# Altium schematic sheet 23cm_amplifier.SchDoc: 23cm amplifier with YP2233W
size A3; DrawnBy: Lars Horvath; Organization: HB9ZZ; DocumentNumber: 1; Revision: 1.0
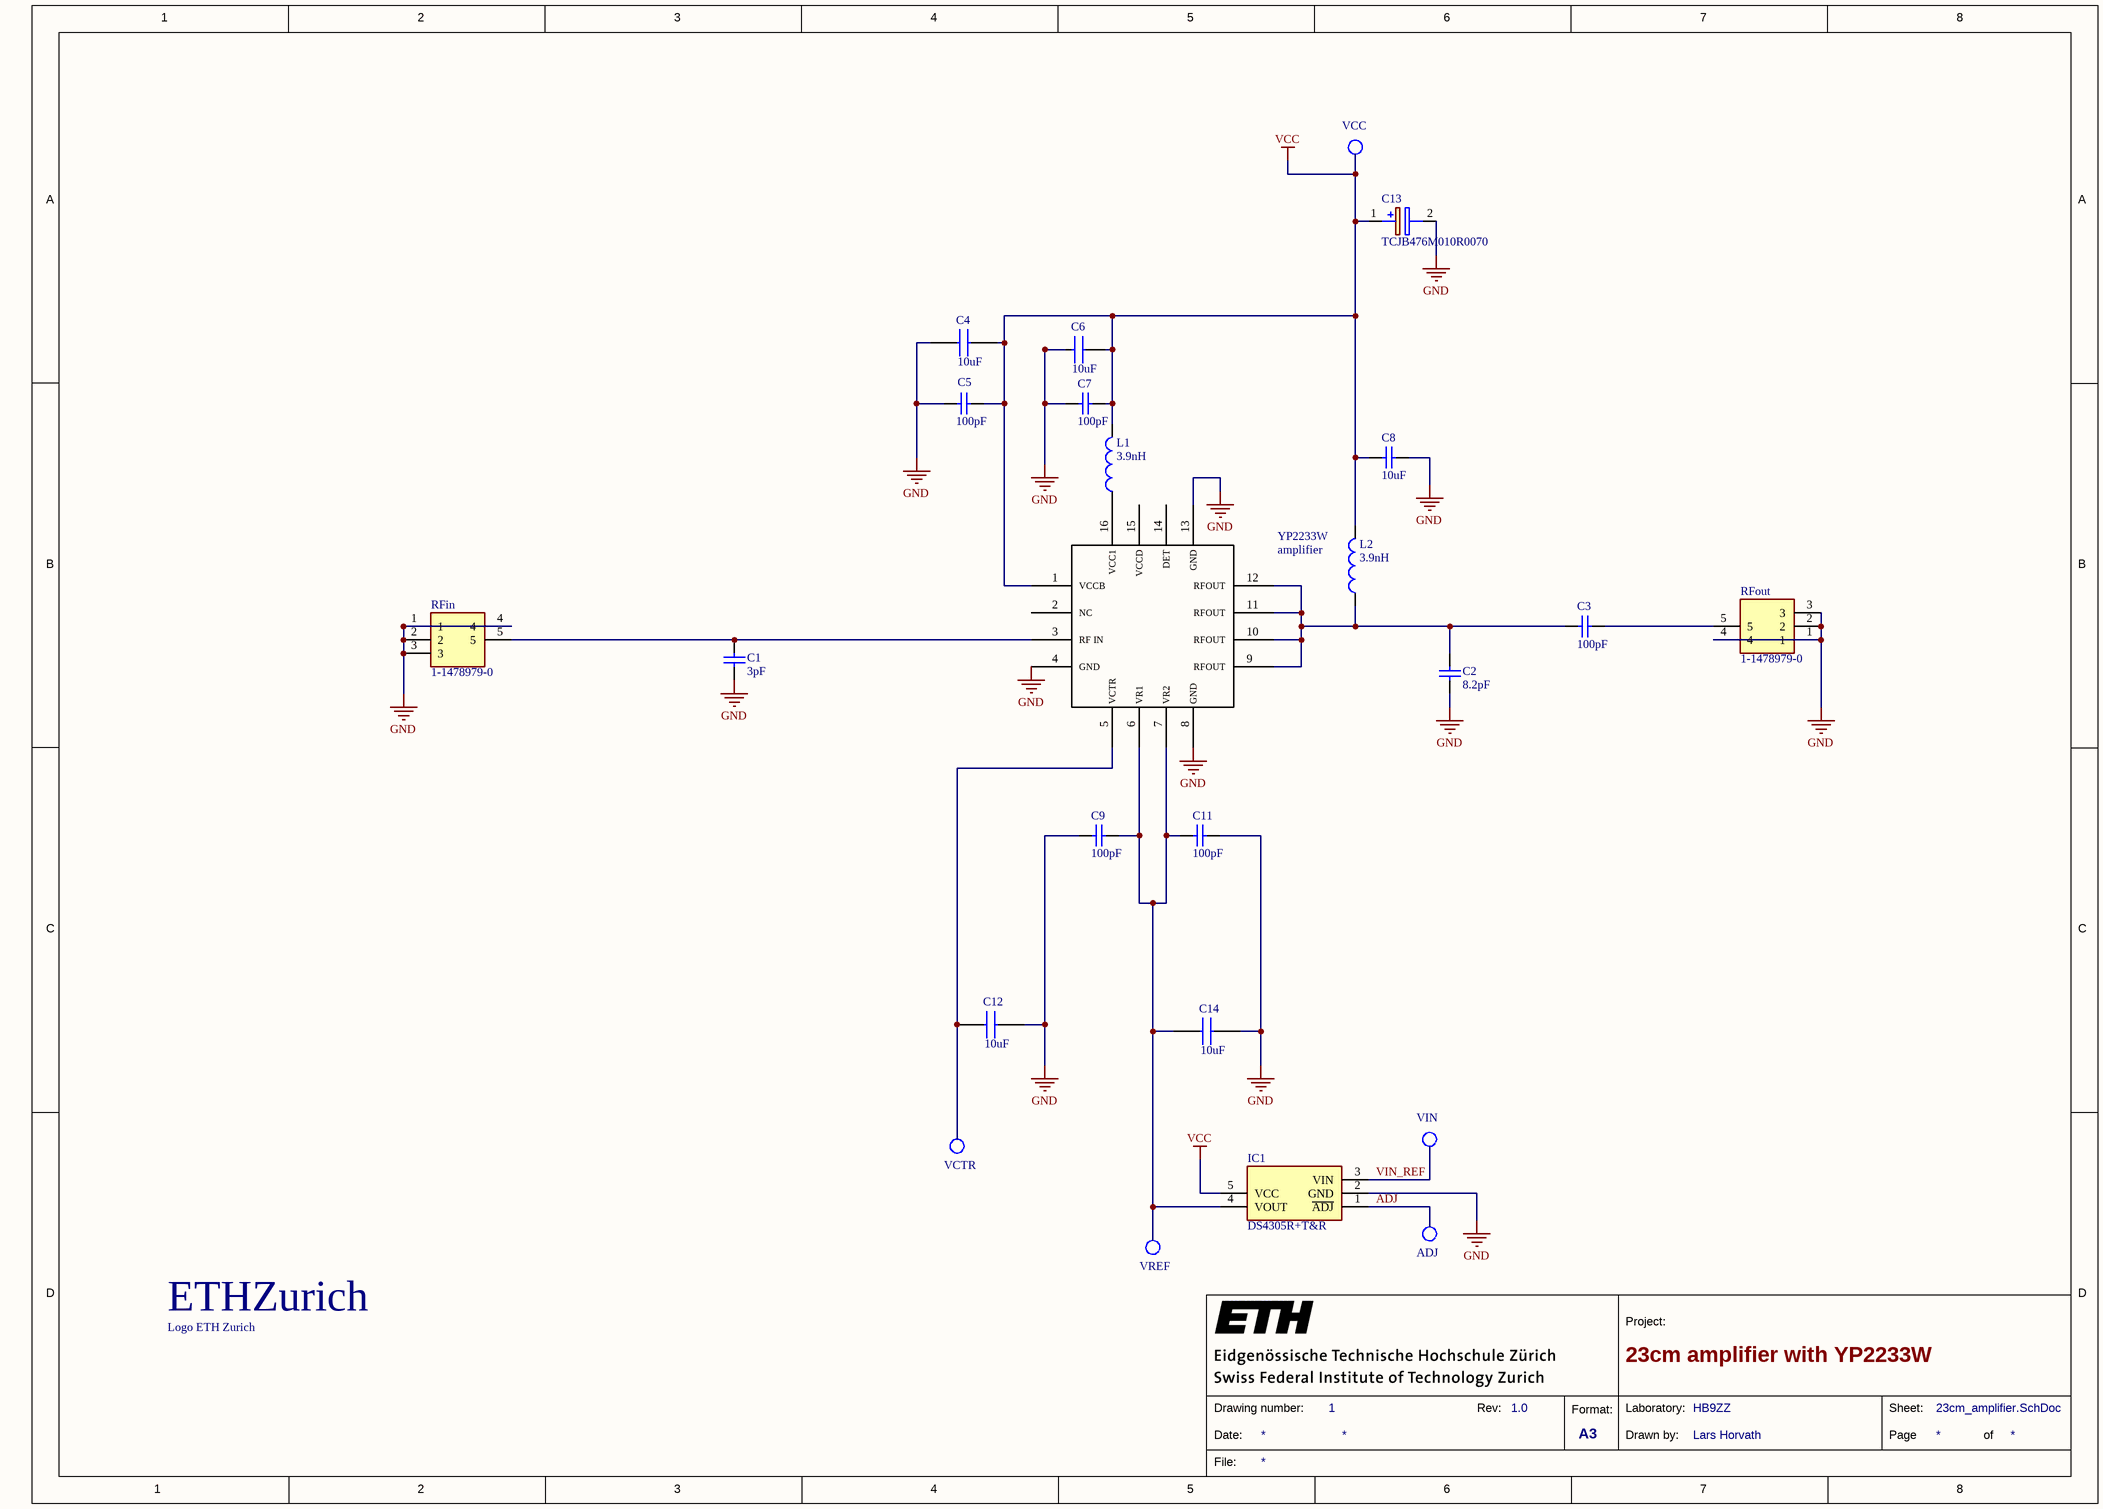
[diagram p0: 23cm_amplifier.SchDoc]

## Parts
A1  Logo ETH Zurich  [eth-zurich_3mm]  (no BOM)
C1  value 3pF  [CAPC0402(1005)70_N]  (hidden comment: 04023J3R0ABSTR)
C2  value 8.2pF  [CAPC0402(1005)70_N]  (hidden comment: 0402YJ8R2BBSTR)
C3  value 100pF  [CAPC0402(1005)70_N]  (hidden comment: C1005C0G1H101J050BE)
C4  Capacity: 10uF  [CAPC2012X145N]  (hidden comment: C2012X8L1A106K125AC)
C5  value 100pF  [CAPC0402(1005)70_N]  (hidden comment: C1005C0G1H101J050BE)
C6  Capacity: 10uF  [CAPC2012X145N]  (hidden comment: C2012X8L1A106K125AC)
C7  value 100pF  [CAPC0402(1005)70_N]  (hidden comment: C1005C0G1H101J050BE)
C8  value 10uF  [CAPC0402(1005)70_N]  (hidden comment: GRM155R60J106ME15J)
C9  value 100pF  [CAPC0402(1005)70_N]  (hidden comment: C1005C0G1H101J050BE)
C11  value 100pF  [CAPC0402(1005)70_N]  (hidden comment: C1005C0G1H101J050BE)
C12  Capacity: 10uF  [CAPC2012X145N]  (hidden comment: C2012X8L1A106K125AC)
C13  TCJB476M010R0070  [CAPPM3528X210N]
C14  Capacity: 10uF  [CAPC2012X145N]  (hidden comment: C2012X8L1A106K125AC)
IC1  DS4305R+T&R  [SOT95P280X145-5N]
L1  value 3.9nH  [INDC1005X07N]  (hidden comment: LQW15AN3N9B8ZD)
L2  value 3.9nH  [INDC1005X07N]  (hidden comment: LQW15AN3N9B8ZD)
RFin  1-1478979-0  [114789790]
RFout  1-1478979-0  [114789790]
YP2233W  amplifier  [YP2233W]

## Nets
GND: C1.1 C2.1 C4.1 C5.1 C6.1 C7.1 C8.2 C9.1 C11.2 C12.2 C13.2(-) C14.2 IC1.2(GND) RFin.1 RFin.2 RFin.3 RFin.4 RFout.1 RFout.2 RFout.3 RFout.4 YP2233W.4(GND) YP2233W.8(GND) YP2233W.13(GND)
VCC: C4.2 C5.2 C6.2 C7.2 C8.1 C13.1(+) IC1.5(VCC) L1.2 L2.2 YP2233W.1(VCCB)
ADJ: IC1.1(~{ADJ})
VIN_REF: IC1.3(VIN)
NetC1_2: C1.2 RFin.5 YP2233W.3(RF_IN)
NetC2_2: C2.2 C3.1 L2.1 YP2233W.9(RFOUT) YP2233W.10(RFOUT) YP2233W.11(RFOUT) YP2233W.12(RFOUT)
NetC3_2: C3.2 RFout.5
NetC9_2: C9.2 C11.1 C14.1 IC1.4(VOUT) YP2233W.6(VR1) YP2233W.7(VR2)
NetC12_1: C12.1 YP2233W.5(VCTR)
NetL1_1: L1.1 YP2233W.16(VCC1)

Not connected (* = marked no-connect by the designer): YP2233W 2(NC) 14(DET) 15(VCCD)

## Notes on the sheet
- VCC
- VIN
- VCTR
- ADJ
- VREF
- 1
- 2
- 3
- 4
- 5
- 6
- 7
- 8
- A
- B
- C
- D
- Project:
- Date:
- Drawing number:
- Rev:
- Format:
- A3
- Drawn by:
- Laboratory:
- Page
- Sheet:
- of
- File:
- (in symbol CMP-00038-1) ETHZurich

## Library data of the parts
A1 = CMP-00038-1
C1 = CMP-00674-1: Silizium-HF-Kondensatoren / Dünnfilm 25V 3pF .05pFTol ThinFilm 0402; Manufacturer: Murata; Tolerance: 5%; Dielectric: C0G(NP0); Mount: Surface Mount; Case/Package: 0402; Case Code (Metric): 1005; Case Code (Imperial): 0402; Min Operating Temperature: -55°C; Max Operating Temperature: 125°C; Capacitance: 3pF; Voltage Rating (DC): 25V; Termination: SMD/SMT; Length: 1mm; Height: 0.5mm; Width: 0.02inch; Thickness: 0.022inch; Depth: 0.5mm; Lead Free: Lead Free; Manufacturer Part Number: 04023J3R0ABSTR; ComponentLink1Description: Mouser; ComponentLink1URL: https://www.mouser.ch/ProductDetail/581-04023J3R0ABSTR
C2 = CMP-00674-1: Silizium-HF-Kondensatoren / Dünnfilm 16V 8.2pF .1pFTol ThinFilm 0402 / RoHS-konform; Manufacturer: Murata; Manufacturer Part Number: GRM1555C1E560JA01D; Tolerance: 5%; Voltage Rating (DC): 25V; Dielectric: C0G(NP0); Mount: Surface Mount; Case/Package: 0402; Case Code (Metric): 1005; Case Code (Imperial): 0402; Min Operating Temperature: -55°C; Max Operating Temperature: 125°C; Capacitance: 8.2pF; Termination: SMD/SMT; Length: 1mm; Height: 0.5mm; Width: 0.02inch; Thickness: 0.022inch; Depth: 0.5mm; Lead Free: Lead Free; ComponentLink1Description: Mouser; ComponentLink1URL: https://www.mouser.ch/ProductDetail/581-0402YJ8R2BBSTR
C3 C5 C7 C9 C11 = CMP-00674-1: Kondensator aus mehreren Keramikschichten MLCC - SMD/SMT SOFT 0402 50V 100pF C0G 5% T: 0.5mm / RoHS-konform; Manufacturer: TDK; Voltage Rating (DC): 25V; Dielectric: C0G(NP0); Mount: Surface Mount; Case/Package: 0402; Case Code (Metric): 1005; Case Code (Imperial): 0402; Min Operating Temperature: -55°C; Max Operating Temperature: 125°C; Capacitance: 100pF; Tolerance: 5%; Termination: SMD/SMT; Length: 1mm; Height: 0.5mm; Width: 0.02inch; Thickness: 0.022inch; Depth: 0.5mm; Lead Free: Lead Free; Manufacturer Part Number: C1005C0G1H101J050BE; ComponentLink1Description: Mouser; ComponentLink1URL: https://www.mouser.ch/ProductDetail/810-C1005C0G1H101JBE
C4 C6 C12 C14 = C2012X8L1A106K125AC: Kondensator aus mehreren Keramikschichten MLCC - SMD/SMT 0805 10VDC 10uF 10% X8L; Manufacturer_Name: TDK; Datasheet Link: https://product.tdk.com/info/en/catalog/datasheets/mlcc_commercial_midvoltage_en.pdf; Height: 1.45mm; Manufacturer_Part_Number: C2012X8L1A106K125AC; Mouser Part Number: 810-C2012X8L106K125C; Mouser Price/Stock: https://www.mouser.co.uk/ProductDetail/TDK/C2012X8L1A106K125AC?qs=P1JMDcb91o46CKBinU4Lfg%3D%3D; ComponentLink1Description: Mouser; ComponentLink1URL: https://www.mouser.ch/ProductDetail/810-C2012X8L106K125C
C8 = CMP-00674-1: Kondensator aus mehreren Keramikschichten MLCC - SMD/SMT 10UF 6.3V 20% 0402 / RoHS-konform; Manufacturer: Murata; Tolerance: 5%; Voltage Rating (DC): 25V; Dielectric: C0G(NP0); Mount: Surface Mount; Case/Package: 0402; Case Code (Metric): 1005; Case Code (Imperial): 0402; Min Operating Temperature: -55°C; Max Operating Temperature: 125°C; Capacitance: 10uF; Termination: SMD/SMT; Length: 1mm; Height: 0.5mm; Width: 0.02inch; Thickness: 0.022inch; Depth: 0.5mm; Lead Free: Lead Free; Manufacturer Part Number: GRM155R60J106ME15J; ComponentLink1Description: Mouser; ComponentLink1URL: https://www.mouser.ch/ProductDetail/81-GRM155R60J106ME5J
C13 = TCJB476M010R0070: Tantalum Capacitors - Polymer 10V 47uF 20% 1210 ESR=70mOhm; Manufacturer_Name: AVX; Datasheet Link: http://datasheets.avx.com/TCJ.pdf; Height: 2.1mm; Manufacturer_Part_Number: TCJB476M010R0070; Arrow Part Number: TCJB476M010R0070; Arrow Price/Stock: https://www.arrow.com/en/products/tcjb476m010r0070/avx; Mouser Part Number: 581-TCJB476M10R70; Mouser Price/Stock: https://www.mouser.com/Search/Refine.aspx?Keyword=581-TCJB476M10R70; ComponentLink1Description: Mouser; ComponentLink1URL: https://www.mouser.ch/ProductDetail/581-TCJB476M10R70
IC1 = DS4305R+T&R: Programmable Reference Voltage for 2.65V; Manufacturer_Name: Maxim Integrated; Datasheet Link: https://componentsearchengine.com/Datasheets/1/DS4305R+T&R.pdf; Height: 1.45mm; Manufacturer_Part_Number: DS4305R+T&R; Mouser Part Number: 700-DS4305RT&R; Mouser Price/Stock: https://www.mouser.co.uk/ProductDetail/Maxim-Integrated/DS4305R%2bTR?qs=GxOUx7aO6nxNFZIWlDSGaA%3D%3D; ComponentLink1Description: Datasheet; ComponentLink1URL: https://www.mouser.ch/datasheet/2/256/DS4305-DS4305K-1514614.pdf; ComponentLink2Description: Mouser; ComponentLink2URL: https://www.mouser.ch/ProductDetail/Maxim-Integrated/DS4305R%2bTR?qs=GxOUx7aO6nxNFZIWlDSGaA%3D%3D
L1 L2 = CMP-00986-1: Festinduktivitäten 0402 3.9nH 1950mA 0.03ohms 10GHz; Core Material: Ceramic; Tolerance: 5%; Current Rating: 250mA; Shielding: Unshielded; DC Resistance (DCR): 900mR; Self Resonant Frequency: 1.6GHz; Mount: Surface Mount; Case/Package: 0402; Case Code (Metric): 1005; Case Code (Imperial): 0402; Min Operating Temperature: -55°C; Max Operating Temperature: 125°C; Packaging: Tape and Reel; Inductance: 3.9nH; Test Frequency: 10GHz; Max DC Current: 250mA; DC Current: 250mA; Military Standard: Not; Length: 0.039inch; Height: 0.55mm; Width: 0.02inch; Depth: 0.55mm; Radiation Hardening: No; ComponentLink1Description: Mouser; ComponentLink1URL: https://www.mouser.ch/ProductDetail/81-LQW15AN3N9B8ZD
RFin = 1-1478979-0: RF IN; Manufacturer_Name: TE Connectivity; Datasheet Link: http://www.te.com/commerce/DocumentDelivery/DDEController?Action=showdoc&DocId=Customer+Drawing%7F1478979%7FB%7Fpdf%7FEnglish%7FENG_CD_1478979_B.pdf%7F1-1478979-0; Height: 10mm; Manufacturer_Part_Number: 1-1478979-0; Arrow Part Number: 1-1478979-0; Arrow Price/Stock: https://www.arrow.com/en/products/1-1478979-0/te-connectivity; Mouser Part Number: 571-1-1478979-0; Mouser Price/Stock: https://www.mouser.co.uk/ProductDetail/TE-Connectivity/1-1478979-0?qs=Vcr9%2FL0R50jLfIYfi0kfuw%3D%3D
RFout = 1-1478979-0: RF OUT; Manufacturer_Name: TE Connectivity; Datasheet Link: http://www.te.com/commerce/DocumentDelivery/DDEController?Action=showdoc&DocId=Customer+Drawing%7F1478979%7FB%7Fpdf%7FEnglish%7FENG_CD_1478979_B.pdf%7F1-1478979-0; Height: 10mm; Manufacturer_Part_Number: 1-1478979-0; Arrow Part Number: 1-1478979-0; Arrow Price/Stock: https://www.arrow.com/en/products/1-1478979-0/te-connectivity; Mouser Part Number: 571-1-1478979-0; Mouser Price/Stock: https://www.mouser.co.uk/ProductDetail/TE-Connectivity/1-1478979-0?qs=Vcr9%2FL0R50jLfIYfi0kfuw%3D%3D
YP2233W = YP2233W: ComponentLink1Description: Datasheet; ComponentLink1URL: http://pro366bdc.pic21.websiteonline.cn/upload/innotionyp2233wdatasheet_8gzy.pdf